# EasyEDA schematic SCH_gravmaskin_sandare_2024-06-04.json
TITLE: Sheet_1; REV: 1.0; Date: 2024-01-15; Sheet: 1/1; Company: Kopparbo
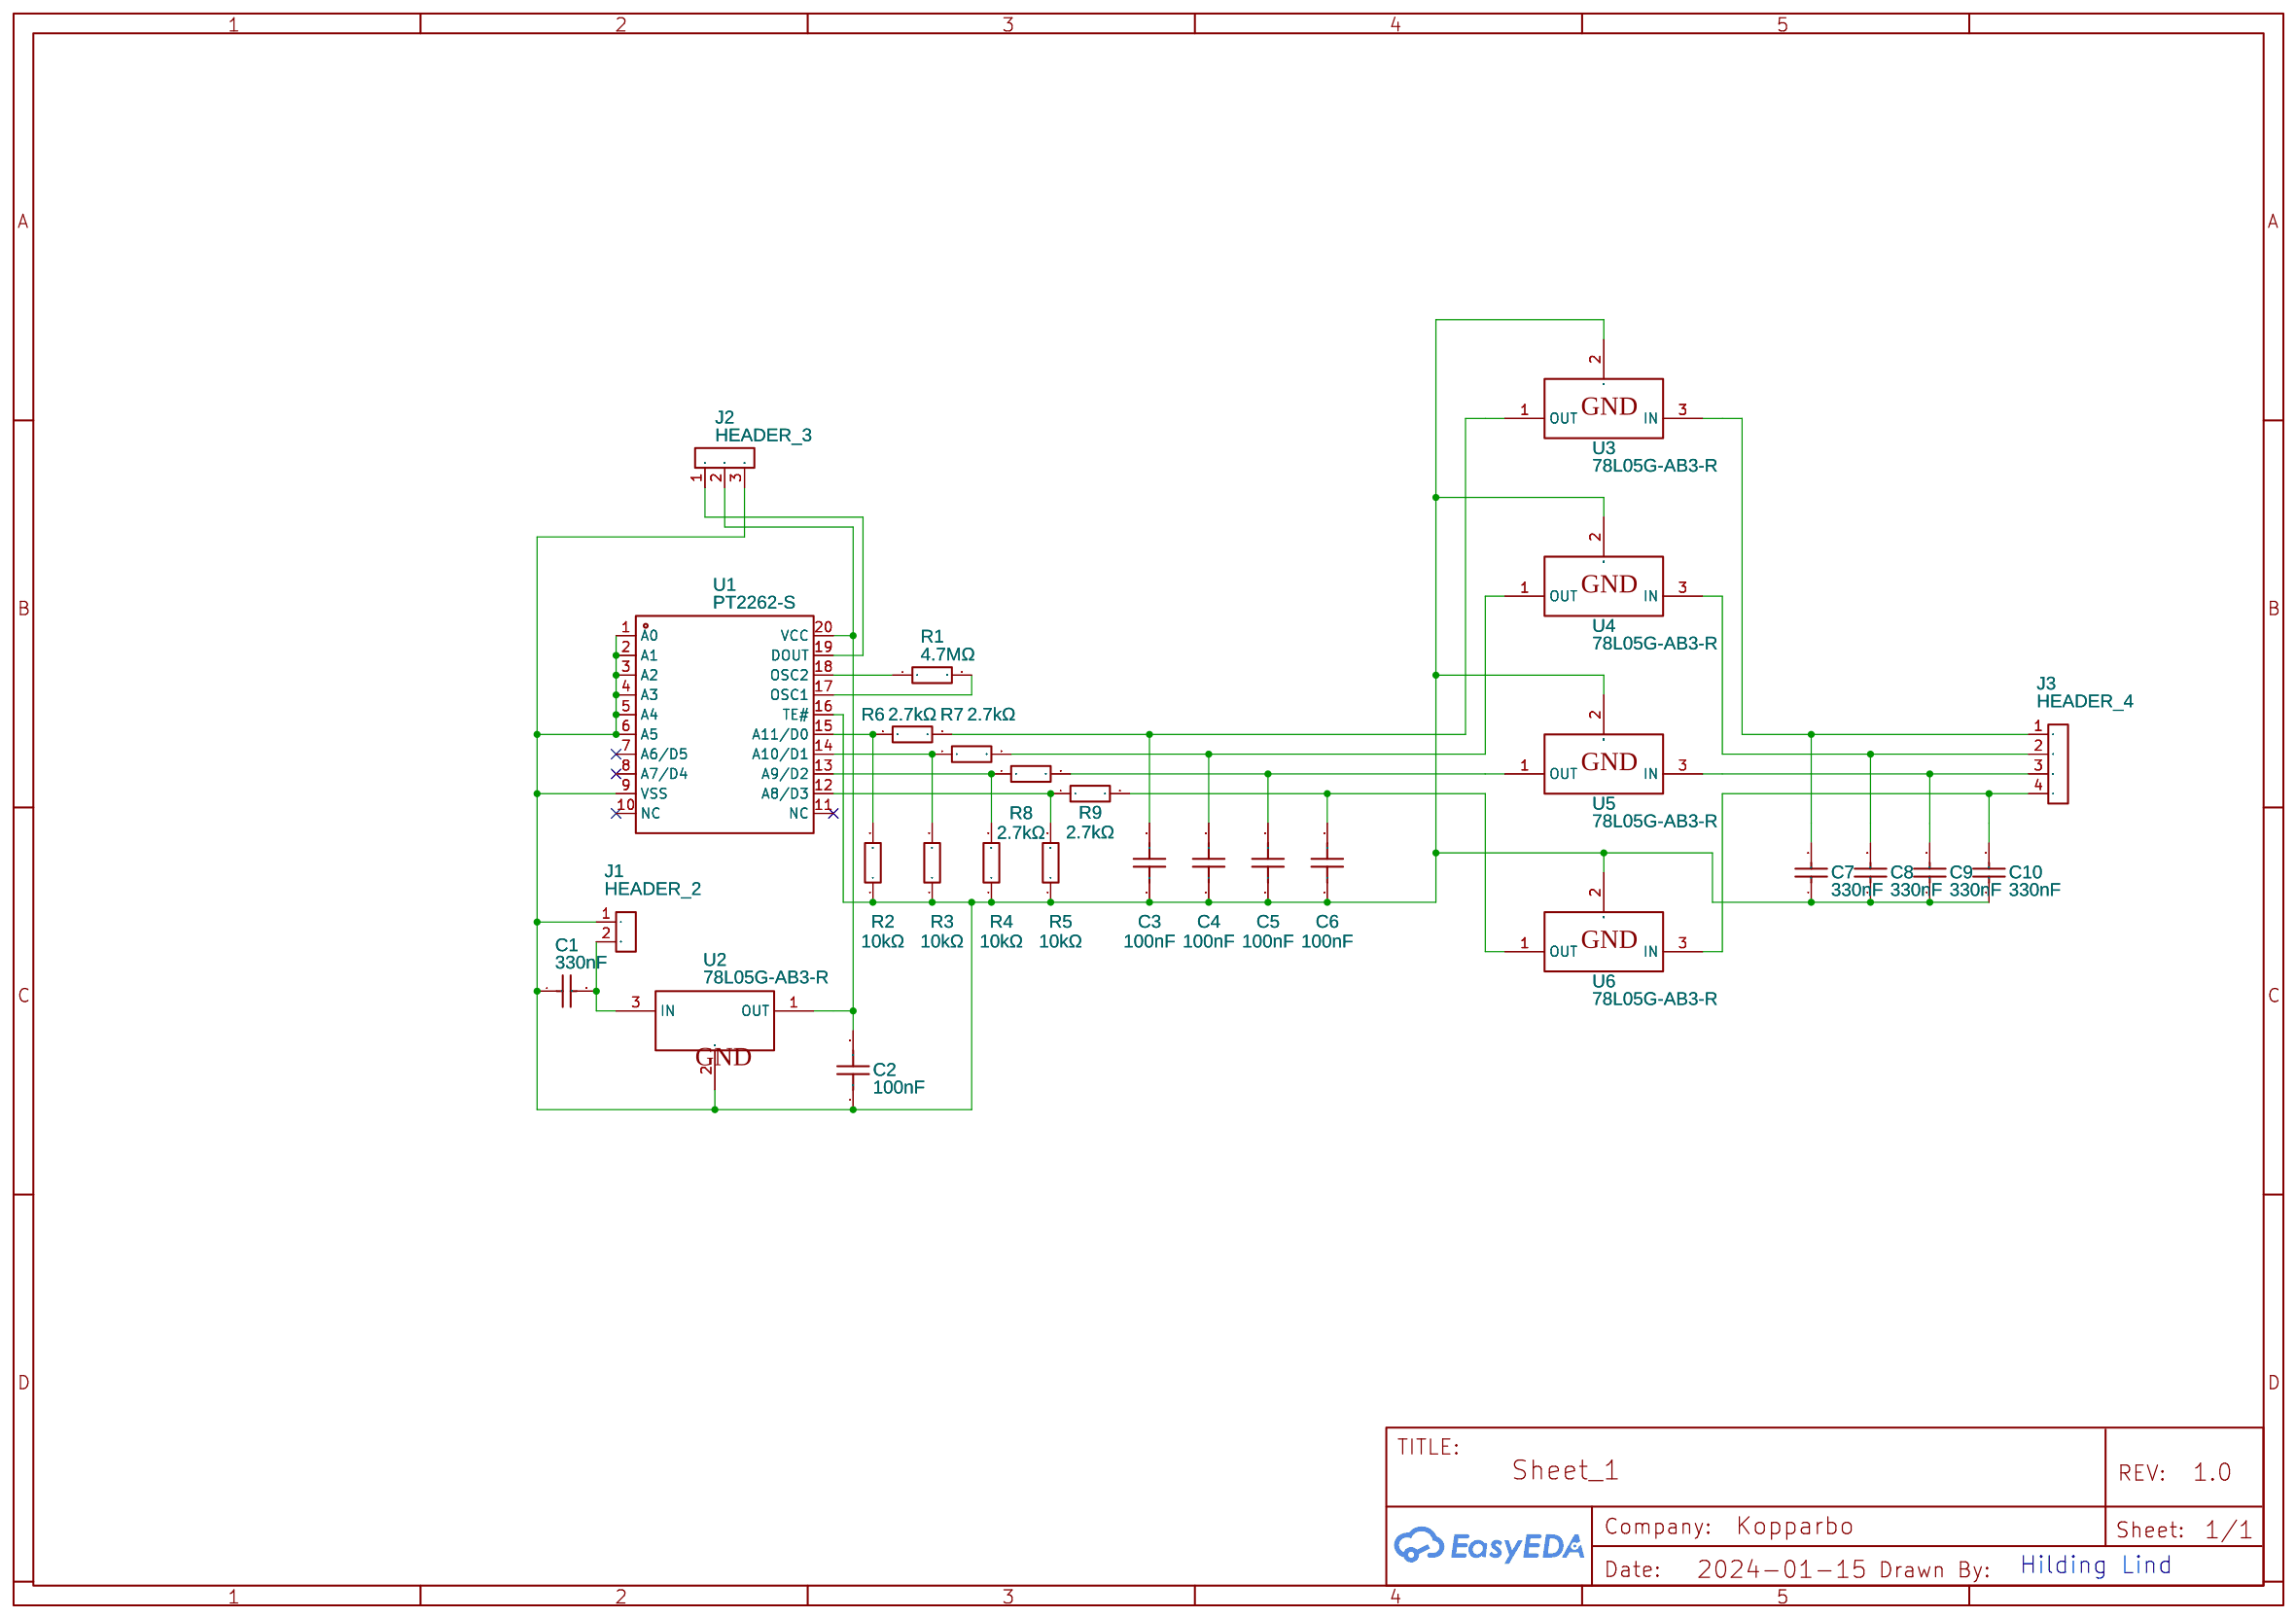
[diagram p0: schematic sheet]

## Parts
C1  330nF  [C0603]
C2  100nF  [C0603]
C3  100nF  [C0603]
C4  100nF  [C0603]
C5  100nF  [C0603]
C6  100nF  [C0603]
C7  330nF  [C0603]
C8  330nF  [C0603]
C9  330nF  [C0603]
C10  330nF  [C0603]
J1  HEADER_2  [1X02]
J2  HEADER_3  [1X03]
J3  HEADER_4  [1X04]
R1  4.7MΩ  [R0603]
R2  10kΩ  [R0402]
R3  10kΩ  [R0402]
R4  10kΩ  [R0402]
R5  10kΩ  [R0402]
R6  2.7kΩ  [R0603]
R7  2.7kΩ  [R0603]
R8  2.7kΩ  [R0603]
R9  2.7kΩ  [R0603]
U1  PT2262-S  [SOP-20_L12.8-W7.5-P1.27-LS10.4-BL]
U2  78L05G-AB3-R  [SOT-89-3_L4.5-W2.5-P1.50-LS4.2-BR]
U3  78L05G-AB3-R  [SOT-89-3_L4.5-W2.5-P1.50-LS4.2-BR]
U4  78L05G-AB3-R  [SOT-89-3_L4.5-W2.5-P1.50-LS4.2-BR]
U5  78L05G-AB3-R  [SOT-89-3_L4.5-W2.5-P1.50-LS4.2-BR]
U6  78L05G-AB3-R  [SOT-89-3_L4.5-W2.5-P1.50-LS4.2-BR]

## Library data of the parts
C1 C7-C10 = 0603B334K250NT: Supplier: LCSC; Manufacturer: FH(风华); Supplier Part: C1615; JLCPCB Part Class: Extended Part
C2-C6 = CC0603KRX7R9BB104: Supplier: LCSC; Manufacturer: YAGEO(国巨); Supplier Part: C14663; JLCPCB Part Class: Basic Part
J1 = HEADER_2
J2 = HEADER_3
J3 = HEADER_4
R1 = 0603WAF4704T5E: Supplier: LCSC; Manufacturer: UNI-ROYAL(厚声); Supplier Part: C23163; JLCPCB Part Class: Extended Part
R2-R5 = 0402WGF1002TCE: Supplier: LCSC; Manufacturer: UNI-ROYAL(厚声); Supplier Part: C25744; JLCPCB Part Class: Basic Part
R6-R9 = 0603WAF2701T5E: Supplier: LCSC; Manufacturer: UNI-ROYAL(厚声); Supplier Part: C13167; JLCPCB Part Class: Basic Part
U1 = PT2262-S: Supplier: LCSC; Manufacturer: PTC(普诚); Supplier Part: C42793; JLCPCB Part Class: Extended Part
U2-U6 = 78L05G-AB3-R: Supplier: LCSC; Manufacturer: UTC(友顺); Supplier Part: C71136; JLCPCB Part Class: Basic Part

## Nets
Net-(C1-1): C1.1 C2.1 C3.1 C4.1 C5.1 C6.1 C7.1 C8.1 C9.1 C10.1 J1.1 J2.3 R2.1 R3.1 R4.1 R5.1 U1.1(A0) U1.2(A1) U1.3(A2) U1.4(A3) U1.5(A4) U1.6(A5) U1.9(VSS) U1.16(TE#) U2.2(GND) U3.2(GND) U4.2(GND) U5.2(GND) U6.2(GND)
Net-(C1-2): C1.2 J1.2 U2.3(IN)
Net-(C2-2): C2.2 J2.2 U1.20(VCC) U2.1(OUT)
Net-(C3-2): C3.2 R6.2 U3.1(OUT)
Net-(C4-2): C4.2 R7.2 U4.1(OUT)
Net-(C5-2): C5.2 R8.2 U5.1(OUT)
Net-(C6-2): C6.2 R9.2 U6.1(OUT)
Net-(C7-2): C7.2 J3.1 U3.3(IN)
Net-(C8-2): C8.2 J3.2 U4.3(IN)
Net-(C9-2): C9.2 J3.3 U5.3(IN)
Net-(C10-2): C10.2 J3.4 U6.3(IN)
Net-(J2-1): J2.1 U1.19(DOUT)
Net-(R1-1): R1.1 U1.18(OSC2)
Net-(R1-2): R1.2 U1.17(OSC1)
Net-(R2-2): R2.2 R6.1 U1.15(A11/D0)
Net-(R3-2): R3.2 R7.1 U1.14(A10/D1)
Net-(R4-2): R4.2 R8.1 U1.13(A9/D2)
Net-(R5-2): R5.2 R9.1 U1.12(A8/D3)

Not connected (* = marked no-connect by the designer): U1 7(A6/D5)* 8(A7/D4)* 10(NC)* 11(NC)*

## Notes on the sheet
- Hilding Lind
